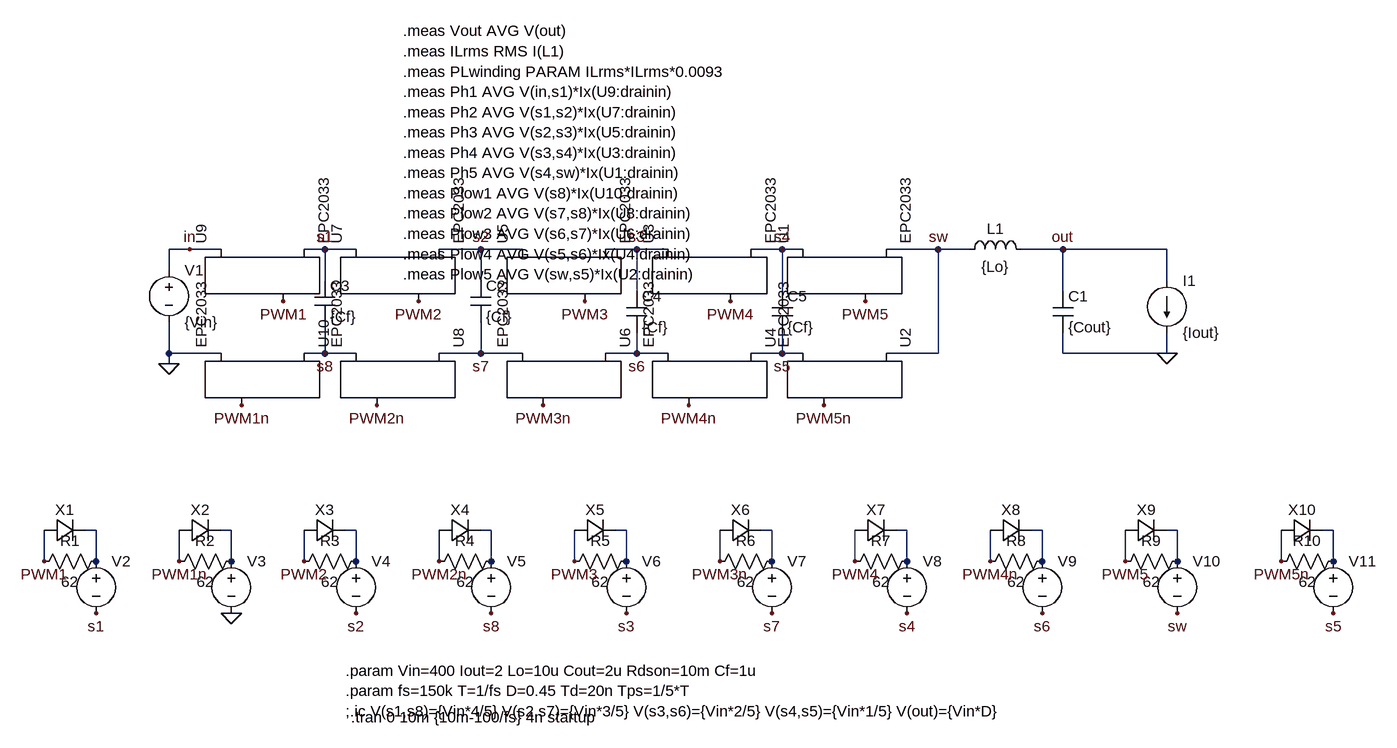
[diagram p0: schematic FCML_5Level_EPC_D045_2A.asc]
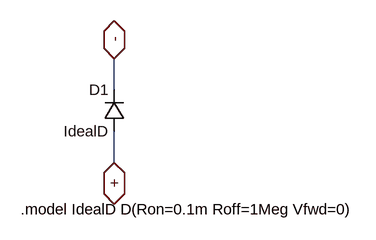
[diagram p1: sub-circuit idealdiode.asc]
FCML_5Level_EPC_D045_2A.asc, the LTspice schematic file:
Version 4
SHEET 1 1628 800
WIRE -192 -48 -224 -48
WIRE -144 -48 -192 -48
WIRE 16 -48 -16 -48
WIRE 64 -48 16 -48
WIRE 256 -48 192 -48
WIRE 320 -48 256 -48
WIRE 496 -48 448 -48
WIRE 544 -48 496 -48
WIRE 720 -48 672 -48
WIRE 752 -48 720 -48
WIRE 960 -48 880 -48
WIRE 1008 -48 960 -48
WIRE 1152 -48 1088 -48
WIRE 1312 -48 1152 -48
WIRE -224 -16 -224 -48
WIRE 16 0 16 -48
WIRE 256 0 256 -48
WIRE 1312 0 1312 -48
WIRE 496 16 496 -48
WIRE 720 16 720 -48
WIRE 1152 16 1152 -48
WIRE -224 112 -224 64
WIRE -144 112 -224 112
WIRE 16 112 16 64
WIRE 16 112 -16 112
WIRE 64 112 16 112
WIRE 256 112 256 64
WIRE 256 112 192 112
WIRE 320 112 256 112
WIRE 496 112 496 80
WIRE 496 112 448 112
WIRE 544 112 496 112
WIRE 720 112 720 80
WIRE 720 112 672 112
WIRE 752 112 720 112
WIRE 960 112 960 -48
WIRE 960 112 880 112
WIRE 1152 112 1152 80
WIRE 1312 112 1312 80
WIRE 1312 112 1152 112
WIRE -224 128 -224 112
WIRE -336 384 -352 384
WIRE -128 384 -144 384
WIRE 64 384 48 384
WIRE 272 384 256 384
WIRE 480 384 464 384
WIRE 704 384 688 384
WIRE 912 384 896 384
WIRE 1120 384 1104 384
WIRE 1328 384 1312 384
WIRE 1568 384 1552 384
WIRE -416 432 -416 384
WIRE -336 432 -336 384
WIRE -208 432 -208 384
WIRE -128 432 -128 384
WIRE -16 432 -16 384
WIRE 64 432 64 384
WIRE 192 432 192 384
WIRE 272 432 272 384
WIRE 400 432 400 384
WIRE 480 432 480 384
WIRE 624 432 624 384
WIRE 704 432 704 384
WIRE 832 432 832 384
WIRE 912 432 912 384
WIRE 1040 432 1040 384
WIRE 1120 432 1120 384
WIRE 1248 432 1248 384
WIRE 1328 432 1328 384
WIRE 1488 432 1488 384
WIRE 1568 432 1568 384
FLAG -224 128 0
FLAG 1312 112 0
FLAG -416 432 PWM1
FLAG -208 432 PWM1n
FLAG -16 432 PWM2
FLAG 192 432 PWM2n
FLAG -192 -48 in
FLAG 960 -48 sw
FLAG 1152 -48 out
FLAG 96 192 PWM2n
FLAG 416 32 PWM3
FLAG 352 192 PWM3n
FLAG -48 32 PWM1
FLAG -112 192 PWM1n
FLAG 400 432 PWM3
FLAG 624 432 PWM3n
FLAG 640 32 PWM4
FLAG 576 192 PWM4n
FLAG 832 432 PWM4
FLAG 1040 432 PWM4n
FLAG 160 32 PWM2
FLAG 848 32 PWM5
FLAG 784 192 PWM5n
FLAG 1248 432 PWM5
FLAG 1488 432 PWM5n
FLAG 16 -48 s1
FLAG 256 -48 s2
FLAG 496 -48 s3
FLAG 720 -48 s4
FLAG 720 112 s5
FLAG 496 112 s6
FLAG 256 112 s7
FLAG 16 112 s8
FLAG -336 512 s1
FLAG -128 512 0
FLAG 64 512 s2
FLAG 272 512 s8
FLAG 480 512 s3
FLAG 704 512 s7
FLAG 1120 512 s6
FLAG 1568 512 s5
FLAG 912 512 s4
FLAG 1328 512 sw
SYMBOL voltage -224 -32 R0
WINDOW 123 0 0 Left 0
WINDOW 39 0 0 Left 0
SYMATTR InstName V1
SYMATTR Value {Vin}
SYMBOL ind 992 -32 R270
WINDOW 0 32 56 VTop 2
WINDOW 3 5 56 VBottom 2
SYMATTR InstName L1
SYMATTR Value {Lo}
SYMATTR SpiceLine Rser=9.33m
SYMBOL cap 1136 16 R0
SYMATTR InstName C1
SYMATTR Value {Cout}
SYMATTR SpiceLine Rser=1m
SYMBOL cap 240 0 R0
SYMATTR InstName C2
SYMATTR Value {Cf}
SYMATTR SpiceLine Rser=2m
SYMBOL voltage -336 416 R0
WINDOW 3 24 96 Invisible 2
WINDOW 123 0 0 Left 0
WINDOW 39 0 0 Left 0
SYMATTR Value PULSE(0 5 0 1n 1n {D*T} {T})
SYMATTR InstName V2
SYMBOL voltage -128 416 R0
WINDOW 3 24 96 Invisible 2
SYMATTR Value PULSE(0 5 {D*T+Td} 1n 1n {T-D*T-2*Td} {T})
SYMATTR InstName V3
SYMBOL voltage 64 416 R0
WINDOW 3 24 96 Invisible 2
WINDOW 123 0 0 Left 0
WINDOW 39 0 0 Left 0
SYMATTR Value PULSE(0 5 {Tps} 1n 1n {D*T} {T})
SYMATTR InstName V4
SYMBOL voltage 272 416 R0
WINDOW 3 24 96 Invisible 2
WINDOW 123 0 0 Left 0
WINDOW 39 0 0 Left 0
SYMATTR Value PULSE(0 5 {Tps+D*T+Td} 1n 1n {T-D*T-2*Td} {T})
SYMATTR InstName V5
SYMBOL cap 0 0 R0
SYMATTR InstName C3
SYMATTR Value {Cf}
SYMATTR SpiceLine Rser=2m
SYMBOL voltage 480 416 R0
WINDOW 3 24 96 Invisible 2
WINDOW 123 0 0 Left 0
WINDOW 39 0 0 Left 0
SYMATTR Value PULSE(0 5 {Tps*2} 1n 1n {D*T} {T})
SYMATTR InstName V6
SYMBOL voltage 704 416 R0
WINDOW 3 24 96 Invisible 2
WINDOW 123 0 0 Left 0
WINDOW 39 0 0 Left 0
SYMATTR Value PULSE(0 5 {Tps*2+D*T+Td} 1n 1n {T-D*T-2*Td} {T})
SYMATTR InstName V7
SYMBOL cap 480 16 R0
SYMATTR InstName C4
SYMATTR Value {Cf}
SYMATTR SpiceLine Rser=2m
SYMBOL voltage 912 416 R0
WINDOW 3 24 96 Invisible 2
WINDOW 123 0 0 Left 0
WINDOW 39 0 0 Left 0
SYMATTR Value PULSE(0 5 {Tps*3} 1n 1n {D*T} {T})
SYMATTR InstName V8
SYMBOL voltage 1120 416 R0
WINDOW 3 24 96 Invisible 2
WINDOW 123 0 0 Left 0
WINDOW 39 0 0 Left 0
SYMATTR Value PULSE(0 5 {Tps*3+D*T+Td} 1n 1n {T-D*T-2*Td} {T})
SYMATTR InstName V9
SYMBOL cap 704 16 R0
SYMATTR InstName C5
SYMATTR Value {Cf}
SYMATTR SpiceLine Rser=2m
SYMBOL voltage 1328 416 R0
WINDOW 3 24 96 Invisible 2
WINDOW 123 0 0 Left 0
WINDOW 39 0 0 Left 0
SYMATTR Value PULSE(0 5 {Tps*4} 1n 1n {D*T} {T})
SYMATTR InstName V10
SYMBOL voltage 1568 416 R0
WINDOW 3 24 96 Invisible 2
WINDOW 123 0 0 Left 0
WINDOW 39 0 0 Left 0
SYMATTR Value PULSE(0 5 {Tps*4+D*T+Td} 1n 1n {T-D*T-2*Td} {T})
SYMATTR InstName V11
SYMBOL EPCGaN 848 32 R270
SYMATTR InstName U1
SYMATTR Value EPC2033
SYMBOL EPCGaN 784 192 M270
SYMATTR InstName U2
SYMATTR Value EPC2033
SYMBOL EPCGaN 640 32 R270
SYMATTR InstName U3
SYMATTR Value EPC2033
SYMBOL EPCGaN 576 192 M270
SYMATTR InstName U4
SYMATTR Value EPC2033
SYMBOL EPCGaN 416 32 R270
SYMATTR InstName U5
SYMATTR Value EPC2033
SYMBOL EPCGaN 352 192 M270
SYMATTR InstName U6
SYMATTR Value EPC2033
SYMBOL EPCGaN 160 32 R270
SYMATTR InstName U7
SYMATTR Value EPC2033
SYMBOL EPCGaN 96 192 M270
SYMATTR InstName U8
SYMATTR Value EPC2033
SYMBOL EPCGaN -48 32 R270
SYMATTR InstName U9
SYMATTR Value EPC2033
SYMBOL EPCGaN -112 192 M270
SYMATTR InstName U10
SYMATTR Value EPC2033
SYMBOL res -320 416 R90
WINDOW 0 0 56 VBottom 2
WINDOW 3 32 56 VTop 2
SYMATTR InstName R1
SYMATTR Value 62
SYMBOL res -112 416 R90
WINDOW 0 0 56 VBottom 2
WINDOW 3 32 56 VTop 2
SYMATTR InstName R2
SYMATTR Value 62
SYMBOL res 80 416 R90
WINDOW 0 0 56 VBottom 2
WINDOW 3 32 56 VTop 2
SYMATTR InstName R3
SYMATTR Value 62
SYMBOL res 288 416 R90
WINDOW 0 0 56 VBottom 2
WINDOW 3 32 56 VTop 2
SYMATTR InstName R4
SYMATTR Value 62
SYMBOL res 496 416 R90
WINDOW 0 0 56 VBottom 2
WINDOW 3 32 56 VTop 2
SYMATTR InstName R5
SYMATTR Value 62
SYMBOL res 720 416 R90
WINDOW 0 0 56 VBottom 2
WINDOW 3 32 56 VTop 2
SYMATTR InstName R6
SYMATTR Value 62
SYMBOL res 928 416 R90
WINDOW 0 0 56 VBottom 2
WINDOW 3 32 56 VTop 2
SYMATTR InstName R7
SYMATTR Value 62
SYMBOL res 1136 416 R90
WINDOW 0 0 56 VBottom 2
WINDOW 3 32 56 VTop 2
SYMATTR InstName R8
SYMATTR Value 62
SYMBOL res 1344 416 R90
WINDOW 0 0 56 VBottom 2
WINDOW 3 32 56 VTop 2
SYMATTR InstName R9
SYMATTR Value 62
SYMBOL res 1584 416 R90
WINDOW 0 0 56 VBottom 2
WINDOW 3 32 56 VTop 2
SYMATTR InstName R10
SYMATTR Value 62
SYMBOL IdealSwitch\\IdealDiode -416 400 R270
WINDOW 0 32 32 VTop 2
SYMATTR InstName X1
SYMBOL IdealSwitch\\IdealDiode -208 400 R270
WINDOW 0 32 32 VTop 2
SYMATTR InstName X2
SYMBOL IdealSwitch\\IdealDiode -16 400 R270
WINDOW 0 32 32 VTop 2
SYMATTR InstName X3
SYMBOL IdealSwitch\\IdealDiode 192 400 R270
WINDOW 0 32 32 VTop 2
SYMATTR InstName X4
SYMBOL IdealSwitch\\IdealDiode 400 400 R270
WINDOW 0 32 32 VTop 2
SYMATTR InstName X5
SYMBOL IdealSwitch\\IdealDiode 624 400 R270
WINDOW 0 32 32 VTop 2
SYMATTR InstName X6
SYMBOL IdealSwitch\\IdealDiode 832 400 R270
WINDOW 0 32 32 VTop 2
SYMATTR InstName X7
SYMBOL IdealSwitch\\IdealDiode 1040 400 R270
WINDOW 0 32 32 VTop 2
SYMATTR InstName X8
SYMBOL IdealSwitch\\IdealDiode 1248 400 R270
WINDOW 0 32 32 VTop 2
SYMATTR InstName X9
SYMBOL IdealSwitch\\IdealDiode 1488 400 R270
WINDOW 0 32 32 VTop 2
SYMATTR InstName X10
SYMBOL current 1312 0 R0
WINDOW 123 0 0 Left 0
WINDOW 39 0 0 Left 0
SYMATTR InstName I1
SYMATTR Value {Iout}
TEXT 48 600 Left 2 !.param Vin=400 Iout=2 Lo=10u Cout=2u Rdson=10m Cf=1u\n.param fs=150k T=1/fs D=0.45 Td=20n Tps=1/5*T\n;.ic V(s1,s8)={Vin*4/5} V(s2,s7)={Vin*3/5} V(s3,s6)={Vin*2/5} V(s4,s5)={Vin*1/5} V(out)={Vin*D}
TEXT 56 672 Left 2 !.tran 0 10m {10m-100/fs} 4n startup
TEXT 136 -384 Left 2 !.meas Vout AVG V(out)\n.meas ILrms RMS I(L1)\n.meas PLwinding PARAM ILrms*ILrms*0.0093\n.meas Ph1 AVG V(in,s1)*Ix(U9:drainin)\n.meas Ph2 AVG V(s1,s2)*Ix(U7:drainin)\n.meas Ph3 AVG V(s2,s3)*Ix(U5:drainin)\n.meas Ph4 AVG V(s3,s4)*Ix(U3:drainin)\n.meas Ph5 AVG V(s4,sw)*Ix(U1:drainin)\n.meas Plow1 AVG V(s8)*Ix(U10:drainin)\n.meas Plow2 AVG V(s7,s8)*Ix(U8:drainin)\n.meas Plow3 AVG V(s6,s7)*Ix(U6:drainin)\n.meas Plow4 AVG V(s5,s6)*Ix(U4:drainin)\n.meas Plow5 AVG V(sw,s5)*Ix(U2:drainin)

idealdiode.asc, the sub-circuit schematic file:
Version 4
SHEET 1 880 680
WIRE 336 144 336 96
WIRE 336 256 336 208
FLAG 336 96 -
IOPIN 336 96 BiDir
FLAG 336 256 +
IOPIN 336 256 BiDir
SYMBOL diode 352 208 R180
WINDOW 0 24 64 Left 2
WINDOW 3 24 0 Left 2
SYMATTR InstName D1
SYMATTR Value IdealD
TEXT 192 328 Left 2 !.model IdealD D(Ron=0.1m Roff=1Meg Vfwd=0)

The netlist it stands for:
* FCML_5Level_EPC_D045_2A.asc
V1 in 0 {Vin}
L1 sw out {Lo} Rser=9.33m
C1 out 0 {Cout} Rser=1m
C2 s2 s7 {Cf} Rser=2m
V2 N001 s1 PULSE(0 5 0 1n 1n {D*T} {T})
V3 N002 0 PULSE(0 5 {D*T+Td} 1n 1n {T-D*T-2*Td} {T})
V4 N003 s2 PULSE(0 5 {Tps} 1n 1n {D*T} {T})
V5 N004 s8 PULSE(0 5 {Tps+D*T+Td} 1n 1n {T-D*T-2*Td} {T})
C3 s1 s8 {Cf} Rser=2m
V6 N005 s3 PULSE(0 5 {Tps*2} 1n 1n {D*T} {T})
V7 N006 s7 PULSE(0 5 {Tps*2+D*T+Td} 1n 1n {T-D*T-2*Td} {T})
C4 s3 s6 {Cf} Rser=2m
V8 N007 s4 PULSE(0 5 {Tps*3} 1n 1n {D*T} {T})
V9 N008 s6 PULSE(0 5 {Tps*3+D*T+Td} 1n 1n {T-D*T-2*Td} {T})
C5 s4 s5 {Cf} Rser=2m
V10 N009 sw PULSE(0 5 {Tps*4} 1n 1n {D*T} {T})
V11 N010 s5 PULSE(0 5 {Tps*4+D*T+Td} 1n 1n {T-D*T-2*Td} {T})
XU1 PWM5 s4 sw EPC2033
XU2 PWM5n sw s5 EPC2033
XU3 PWM4 s3 s4 EPC2033
XU4 PWM4n s5 s6 EPC2033
XU5 PWM3 s2 s3 EPC2033
XU6 PWM3n s6 s7 EPC2033
XU7 PWM2 s1 s2 EPC2033
XU8 PWM2n s7 s8 EPC2033
XU9 PWM1 in s1 EPC2033
XU10 PWM1n s8 0 EPC2033
R1 N001 PWM1 62
R2 N002 PWM1n 62
R3 N003 PWM2 62
R4 N004 PWM2n 62
R5 N005 PWM3 62
R6 N006 PWM3n 62
R7 N007 PWM4 62
R8 N008 PWM4n 62
R9 N009 PWM5 62
R10 N010 PWM5n 62
XX1 PWM1 N001 idealdiode
XX2 PWM1n N002 idealdiode
XX3 PWM2 N003 idealdiode
XX4 PWM2n N004 idealdiode
XX5 PWM3 N005 idealdiode
XX6 PWM3n N006 idealdiode
XX7 PWM4 N007 idealdiode
XX8 PWM4n N008 idealdiode
XX9 PWM5 N009 idealdiode
XX10 PWM5n N010 idealdiode
I1 out 0 {Iout}

* block symbol definitions
.subckt idealdiode + -
D1 + - IdealD
.model IdealD D(Ron=0.1m Roff=1Meg Vfwd=0)
.ends idealdiode

.model D D
.lib standard.dio
.param Vin=400 Iout=2 Lo=10u Cout=2u Rdson=10m Cf=1u
.param fs=150k T=1/fs D=0.45 Td=20n Tps=1/5*T
;.ic V(s1,s8)={Vin*4/5} V(s2,s7)={Vin*3/5} V(s3,s6)={Vin*2/5} V(s4,s5)={Vin*1/5} V(out)={Vin*D}
.tran 0 10m {10m-100/fs} 4n startup
.meas Vout AVG V(out)
.meas ILrms RMS I(L1)
.meas PLwinding PARAM ILrms*ILrms*0.0093
.meas Ph1 AVG V(in,s1)*Ix(U9:drainin)
.meas Ph2 AVG V(s1,s2)*Ix(U7:drainin)
.meas Ph3 AVG V(s2,s3)*Ix(U5:drainin)
.meas Ph4 AVG V(s3,s4)*Ix(U3:drainin)
.meas Ph5 AVG V(s4,sw)*Ix(U1:drainin)
.meas Plow1 AVG V(s8)*Ix(U10:drainin)
.meas Plow2 AVG V(s7,s8)*Ix(U8:drainin)
.meas Plow3 AVG V(s6,s7)*Ix(U6:drainin)
.meas Plow4 AVG V(s5,s6)*Ix(U4:drainin)
.meas Plow5 AVG V(sw,s5)*Ix(U2:drainin)
.backanno
.end